# EAGLE design xyzzy_motor_controller_bottom_v1.0 (EAGLE 7.2.1)
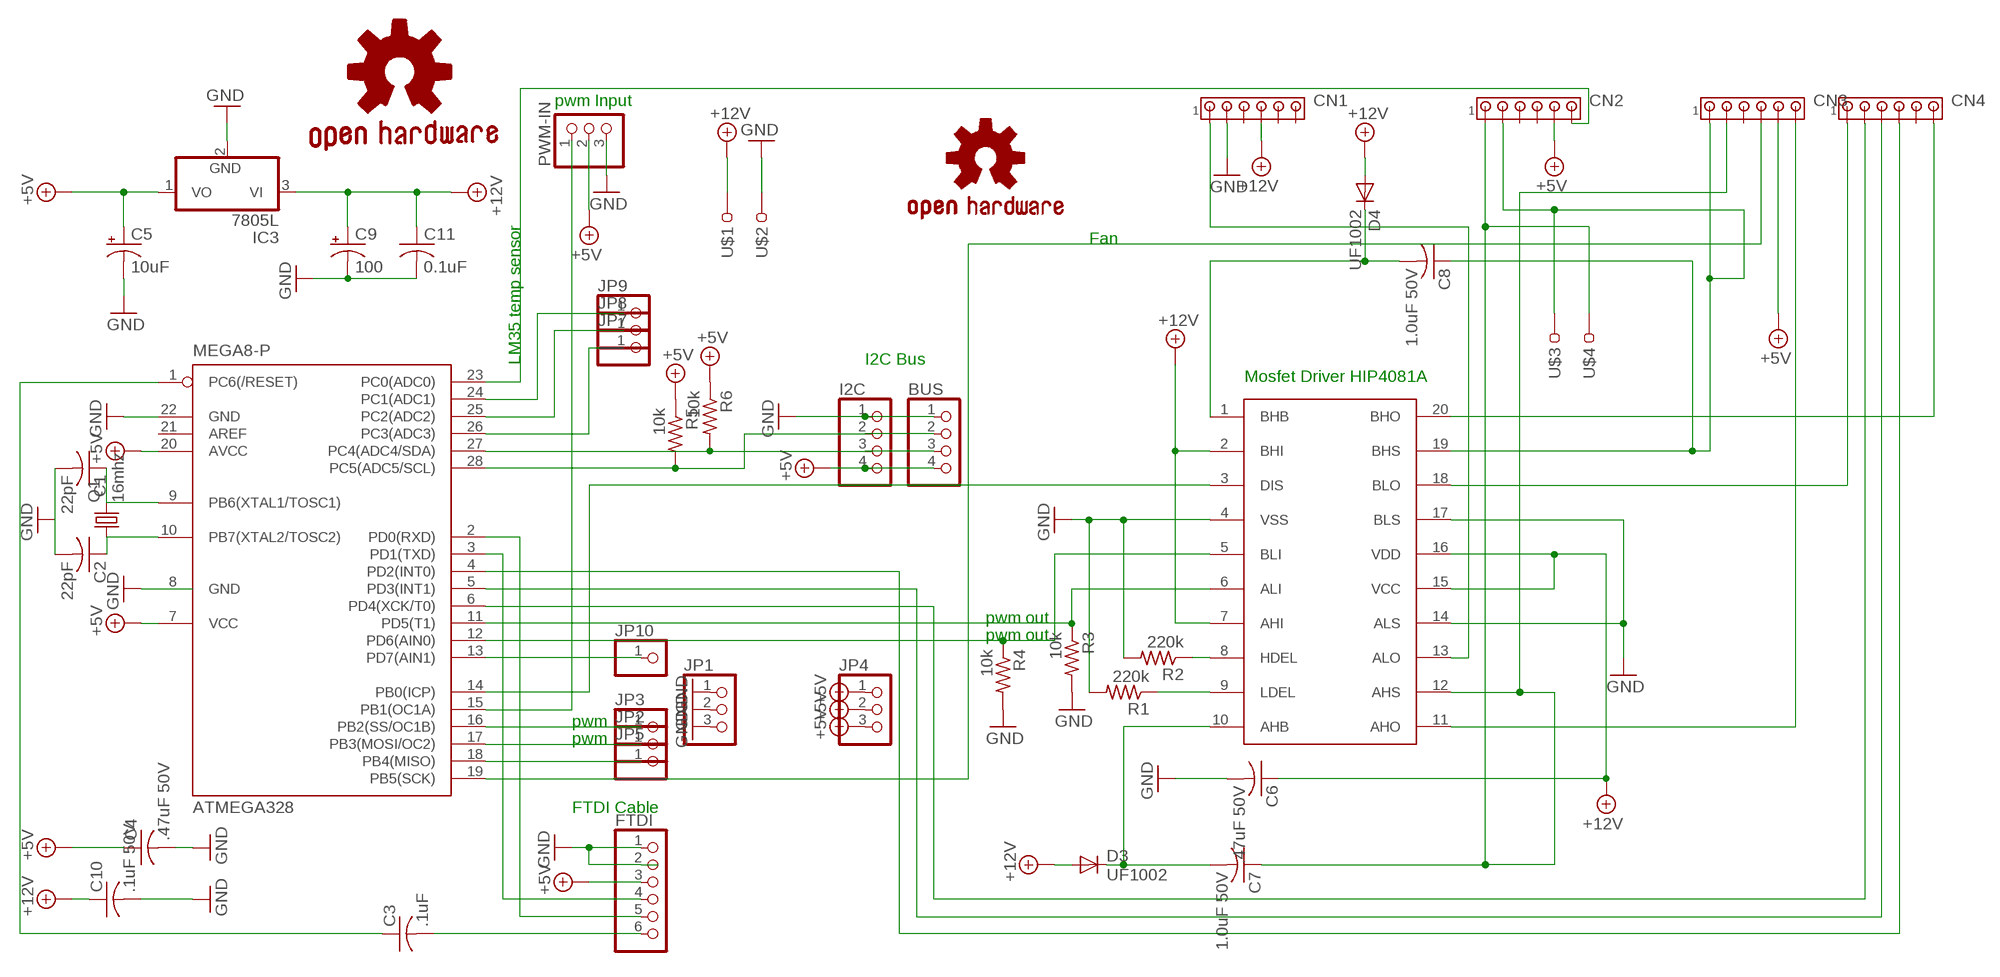
[diagram p0: schematic, sheet 1]

## Parts
ATMEGA328  MEGA8-P  [DIL28-3]
BUS  PINHD-1X4  [1X04]
C1  22pF  C-US025_050-025X075  [C025_050-025X075]
C2  22pF  C-US025_050-025X075  [C025_050-025X075]
C3  .1uF  C-US050-025X075  [C050-025X075]
C4  .47uF 50V  C-US050-025X075  [C050-025X075]
C5  10uF  CPOL-USTT2D4L  [TT2D4L]
C6  .47uF 50V  C-US050-025X075  [C050-025X075]
C7  1.0uF 50V  C-US025-025X050  [C025-025X050]
C8  1.0uF 50V  C-US050-025X075  [C050-025X075]
C9  100  CPOL-USTT2D4L  [TT2D4L]
C10  .1uF 50V  C-US050-025X075  [C050-025X075]
C11  0.1uF  C-US050-025X075  [C050-025X075]
CN1  MTA06-100  [10X06MTA]
CN2  MTA06-100  [10X06MTA]
CN3  MTA06-100  [10X06MTA]
CN4  MTA06-100  [10X06MTA]
D3  UF1002  UF4003  [DO41-10]
D4  UF1002  UF4003  [DO41-10]
FTDI  PINHD-1X6  [1X06]
GOLD_ORB_SM1  OSHWLOGO_GOLD_ORB_LG  [OSHW0]
HIP4081A  HIP4081A  HIP4081ADIP  [DIL20]
I2C  PINHD-1X4  [1X04]
IC3  7805L  [TO92]
JP1  PINHD-1X3  [1X03]
JP2  PINHD-1X1  [1X01]
JP3  PINHD-1X1  [1X01]
JP4  PINHD-1X3  [1X03]
JP5  PINHD-1X1  [1X01]
JP7  PINHD-1X1  [1X01]
JP8  PINHD-1X1  [1X01]
JP9  PINHD-1X1  [1X01]
JP10  PINHD-1X1  [1X01]
LOGO1  OSHW-LOGOL  [OSHW-LOGO-L]
PWM-IN  PINHD-1X3  [1X03]
Q1  16mhz  CRYSTALHC49U-V  [HC49U-V]
R1  220k  R-US_0207/12  [0207/12]
R2  220k  R-US_0207/12  [0207/12]
R3  10k  R-US_0207/12  [0207/12]
R4  10k  R-US_0207/12  [0207/12]
R5  10k  R-US_0207/12  [0207/12]
R6  10k  R-US_0207/12  [0207/12]
U$1  TAB-CON  [SPADE]
U$2  TAB-CON  [SPADE]
U$3  TAB-CON  [SPADE]
U$4  TAB-CON  [SPADE]

## Nets
+5V: ATMEGA328.7(VCC) ATMEGA328.20(AVCC) BUS.4 C4.1 C5.+ CN2.5 CN3.5 I2C.4 IC3.1(VO) JP4.1 JP4.2 JP4.3 PWM-IN.2 R5.1 R6.1
+12V: C6.1 C9.+ C10.1 C11.1 CN1.4 D3.A D4.A HIP4081A.2(BHI) HIP4081A.7(AHI) HIP4081A.15(VCC) HIP4081A.16(VDD) IC3.3(VI) U$1.P$1 U$1.P$2
GND: ATMEGA328.8(GND) ATMEGA328.22(GND) BUS.1 C4.2 C5.- C6.2 C9.- C10.2 C11.2 CN1.2 FTDI.1 FTDI.2 HIP4081A.4(VSS) HIP4081A.14(ALS) HIP4081A.17(BLS) I2C.1 IC3.2(GND) JP1.1 JP1.2 JP1.3 PWM-IN.3 R1.2 R2.2 R3.2 R4.2 U$2.P$1 U$2.P$2
N$1: ATMEGA328.17(PB3(MOSI/OC2)) JP2.1
N$2: C7.2 D3.C HIP4081A.10(AHB)
N$3: ATMEGA328.4(PD2(INT0)) CN4.4
N$4: ATMEGA328.16(PB2(SS/OC1B)) JP3.1
N$5: ATMEGA328.9(PB6(XTAL1/TOSC1)) C1.1 Q1.2
N$6: ATMEGA328.2(PD0(RXD)) FTDI.5
N$7: ATMEGA328.11(PD5(T1)) HIP4081A.6(ALI) R3.1
N$8: CN4.1 HIP4081A.18(BLO)
N$9: CN3.6 HIP4081A.11(AHO)
N$10: ATMEGA328.15(PB1(OC1A)) PWM-IN.1
N$11: ATMEGA328.6(PD4(XCK/T0)) CN4.2
N$12: ATMEGA328.10(PB7(XTAL2/TOSC2)) C2.1 Q1.1
N$13: C1.2 C2.2
N$14: CN1.1 HIP4081A.13(ALO)
N$15: ATMEGA328.3(PD1(TXD)) FTDI.4
N$16: CN4.6 HIP4081A.20(BHO)
N$17: C8.2 D4.C HIP4081A.1(BHB)
N$18: FTDI.3 ; supply symbol labelled +5V
N$19: ATMEGA328.23(PC0(ADC0)) CN2.6
N$20: C7.1 CN2.1 CN3.2 HIP4081A.12(AHS) U$4.P$1 U$4.P$2
N$21: ATMEGA328.28(PC5(ADC5/SCL)) BUS.2 I2C.2 R5.2
N$22: ATMEGA328.12(PD6(AIN0)) HIP4081A.5(BLI) R4.1
N$23: HIP4081A.9(LDEL) R1.1
N$24: HIP4081A.8(HDEL) R2.1
N$25: C8.1 CN2.2 CN3.1 HIP4081A.19(BHS) U$3.P$1 U$3.P$2
N$26: ATMEGA328.14(PB0(ICP)) HIP4081A.3(DIS)
N$27: ATMEGA328.18(PB4(MISO)) JP5.1
N$28: ATMEGA328.19(PB5(SCK)) CN3.4
N$30: ATMEGA328.5(PD3(INT1)) CN4.3
N$33: C3.2 FTDI.6
N$34: ATMEGA328.1(PC6(/RESET)) C3.1
N$35: ATMEGA328.27(PC4(ADC4/SDA)) BUS.3 I2C.3 R6.2
N$36: ATMEGA328.13(PD7(AIN1)) JP10.1
N$41: ATMEGA328.26(PC3(ADC3)) JP7.1
N$45: ATMEGA328.25(PC2(ADC2)) JP8.1
N$47: ATMEGA328.24(PC1(ADC1)) JP9.1
Unconnected: ATMEGA328.21(AREF) CN1.3 CN1.5 CN1.6 CN2.3 CN2.4 CN3.3 CN4.5

## Notes on the sheet
- pwm Input
- Fan
- LM35 temp sensor | I2C Bus
- Mosfet Driver HIP4081A
- pwm out
- pwm out
- pwm
- pwm
- FTDI Cable

## Library data of the parts
ATMEGA328 = atmel:MEGA8-P: MICROCONTROLLER 8 Kbytes FLASH, 1 kbytes SRAM, 512 bytes EEPROM, USART, 4-channel 10 bit ADC, 2-channel 8 bit ADC Pin compatible with Atmega48, ATMega88, ATMega168 Source: avr.lbr; OC_FARNELL: unknown; OC_NEWARK: unknown
BUS I2C = pinhead:PINHD-1X4: PIN HEADER
C1-C4 C6-C8 C10 C11 = rcl:C-US: CAPACITOR, American symbol
C5 C9 = rcl:CPOL-US: POLARIZED CAPACITOR, American symbol
CN1-CN4 = con-amp:MTA06-100: AMP connector Connection corrected 2014-09-19
D3 D4 = diode:UF4003: DIODE ultrafast recovery diode, 200 V rectifier
FTDI = pinhead:PINHD-1X6: PIN HEADER
GOLD_ORB_SM1 = bfl:OSHWLOGO: These are Open-Source Hardware logos.
HIP4081A = andrew_test:HIP4081A
IC3 = linear:78*: Positive VOLTAGE REGULATOR Source: http://cache.national.com/ds/LM/LM78L05.pdf http://www.fairchildsemi.com/ds/LM/LM7805.pdf
JP1 JP4 = adafruit:PINHD-1X3: PIN HEADER
JP2 JP3 JP5 JP7-JP10 = pinhead:PINHD-1X1: PIN HEADER
LOGO1 = SparkFun-Aesthetics:OSHW-LOGO: Open Source Hardware Logo This logo indicates the piece of hardware it is found on incorporates a OSHW license and/or adheres to the definition of open source hardware found here: http://freedomdefined.org/OSHW
PWM-IN = pinhead:PINHD-1X3: PIN HEADER
Q1 = crystal:CRYSTAL: CRYSTAL; OC_FARNELL: 1666969; OC_NEWARK: unknown
R1-R6 = adafruit:R-US_: RESISTOR, American symbol
U$1-U$4 = untitled:TAB-CON: 90 degree spade connector terminal tab. Quick Disconnect Connectors > TE Connectivity AMP Connectors 1217756-1

## Board
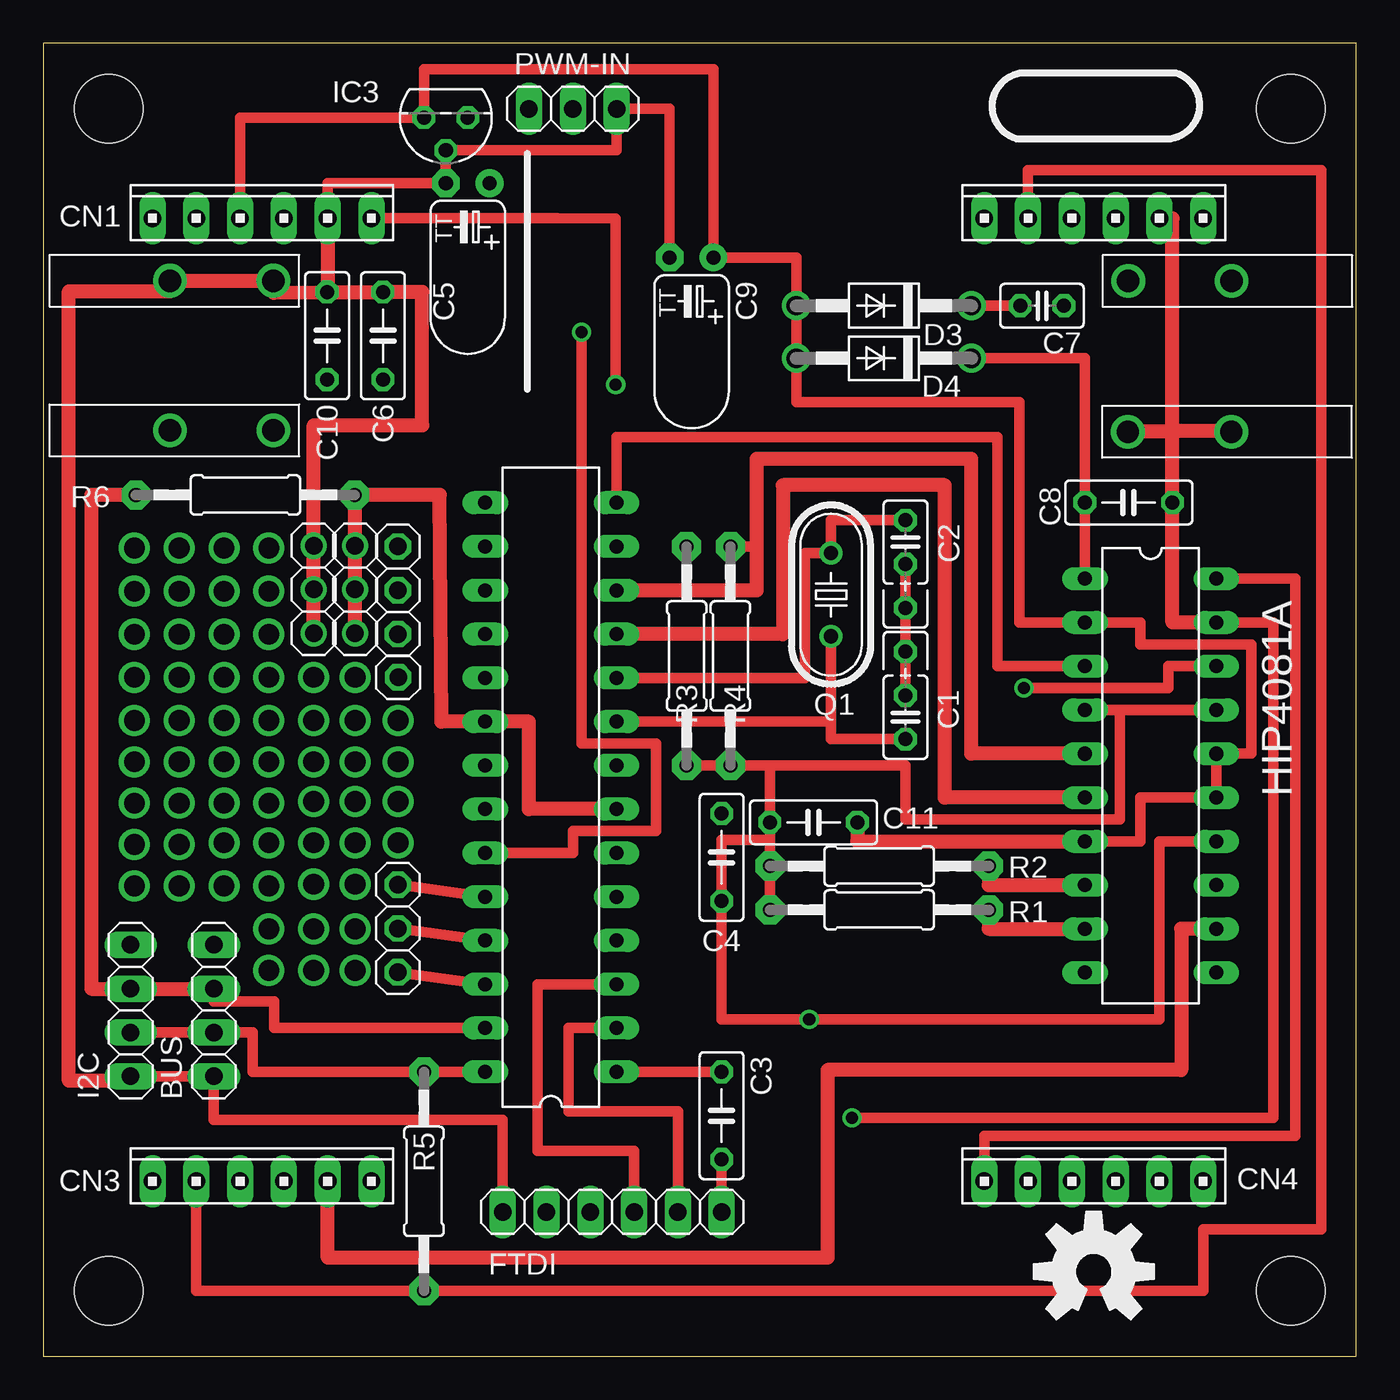
[diagram p1: board, top side]
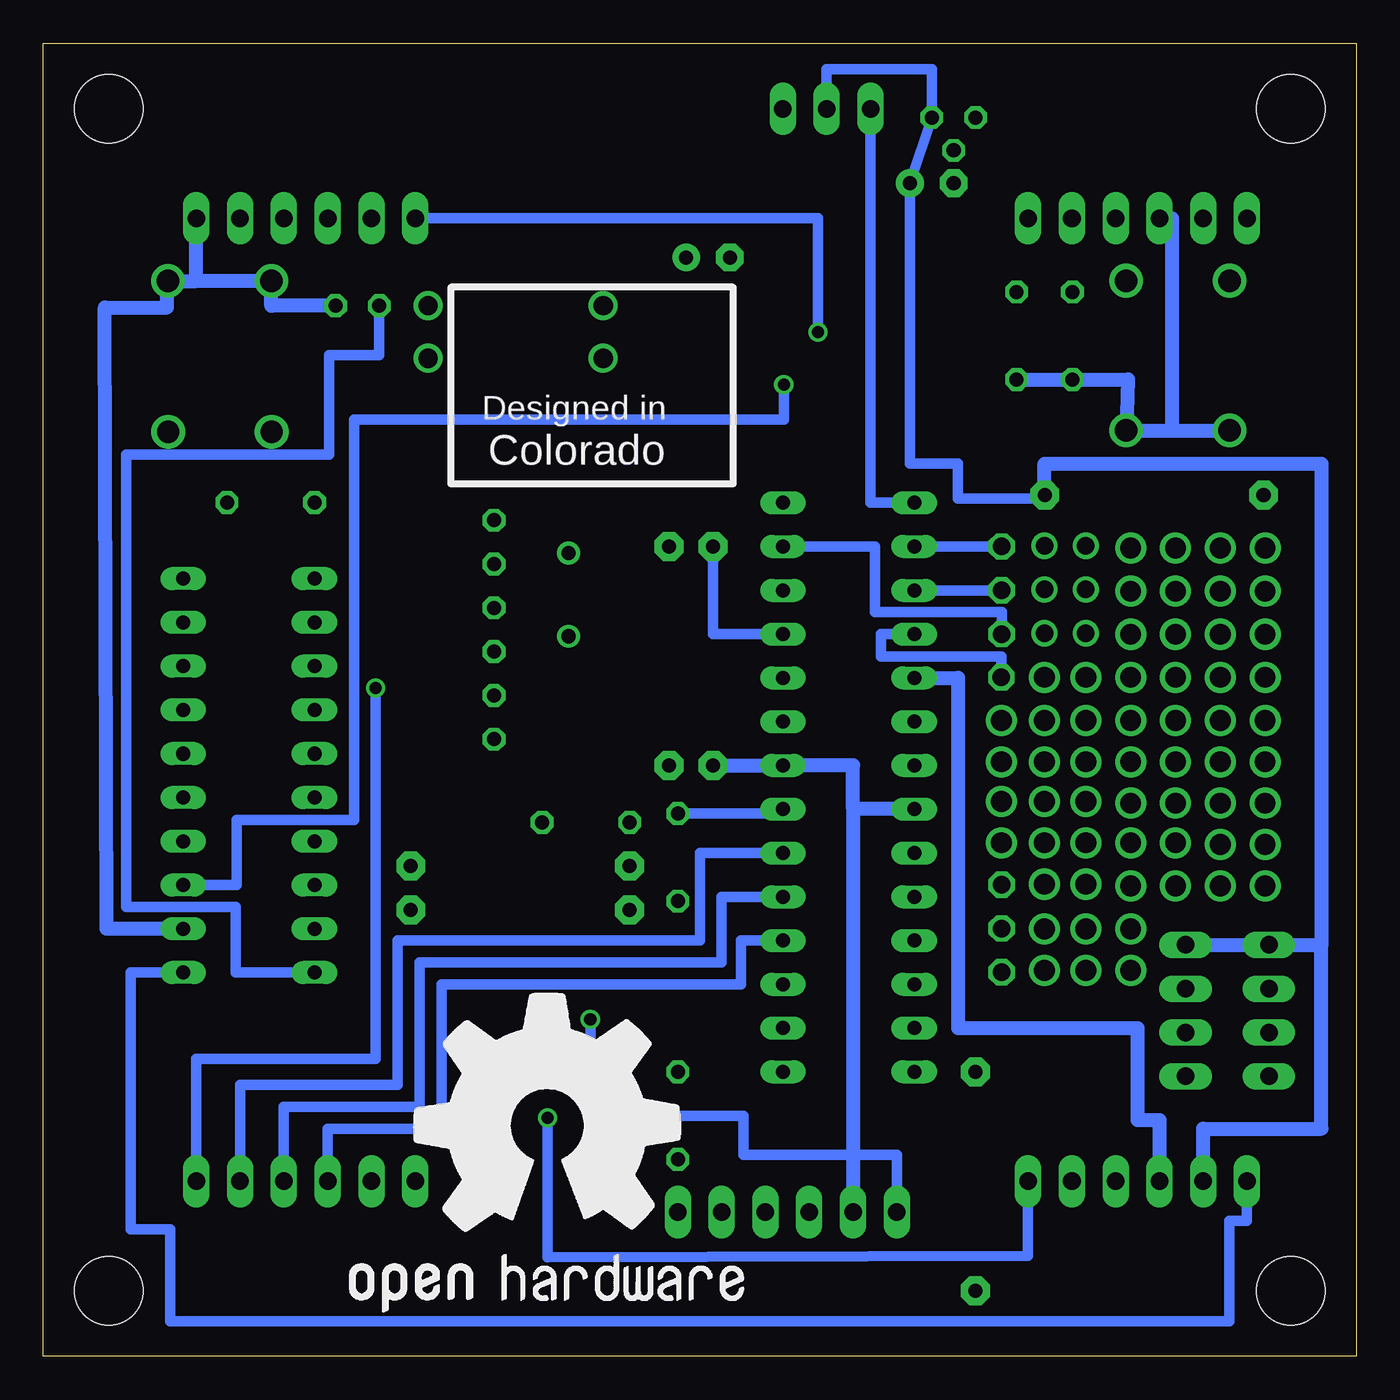
[diagram p2: board, bottom side, seen from below]

Size 76.2 x 76.2 mm. Coordinates in mm from the lower left corner, seen from the top.
Outline: 0,0 76.2,0 76.2,76.2 0,76.2 0,0
Copper layers (1*16): Top 0.035mm / dielectric 1.5mm / Bottom 0.035mm
Design rules "default": minimum track width 10mil, minimum drill 24mil, track to track 8mil, track to pad 8mil, pad to pad 8mil, via to via 8mil, smd to smd 8mil, copper to edge 40mil, drill to drill 8mil, minimum pad ring 10mil, minimum via ring 8mil, stop-mask expansion 4mil, vias tented up to drill 0mil, thermal gap 10mil
Holes 3.97 mm at 72.39,72.39 72.39,3.81 3.81,72.39 3.81,3.81

### Footprints (pad centres in the part's own frame; a part is rotated, then mirrored left to right if it is on the bottom)
DIL28-3 = drill 0.813 long: 1 -16.51,-3.81; 2 -13.97,-3.81; 3 -11.43,-3.81; 4 -8.89,-3.81; 5 -6.35,-3.81; 6 -3.81,-3.81; 7 -1.27,-3.81; 8 1.27,-3.81; 9 3.81,-3.81; 10 6.35,-3.81; 11 8.89,-3.81; 12 11.43,-3.81; 13 13.97,-3.81; 14 16.51,-3.81; 15 16.51,3.81; 16 13.97,3.81; 17 11.43,3.81; 18 8.89,3.81; 19 6.35,3.81; 20 3.81,3.81; 21 1.27,3.81; 22 -1.27,3.81; 23 -3.81,3.81; 24 -6.35,3.81; 25 -8.89,3.81; 26 -11.43,3.81; 27 -13.97,3.81; 28 -16.51,3.81
1X04 = drill 1.016 long: 1 -3.81,0; 2 -1.27,0; 3 1.27,0; 4 3.81,0
C025_050-025X075 = drill 0.813 octagon: 1 -1.27,0; 2 1.27,0; 3 3.81,0
C050-025X075 = drill 0.813 octagon: 1 -2.54,0; 2 2.54,0
TT2D4L = drill 0.813 pad 1.6: + -1.27,0 | drill 0.813 pad 1.6 octagon: - 1.27,0
C025-025X050 = drill 0.813 octagon: 1 -1.27,0; 2 1.27,0
10X06MTA = drill 1.016 long: 1 6.35,0; 2 3.81,0; 3 1.27,0; 4 -1.27,0; 5 -3.81,0; 6 -6.35,0
DO41-10 = drill 1.118: A 5.08,0; C -5.08,0
1X06 = drill 1.016 long: 1 -6.35,0; 2 -3.81,0; 3 -1.27,0; 4 1.27,0; 5 3.81,0; 6 6.35,0
DIL20 = drill 0.813 long: 1 -11.43,-3.81; 2 -8.89,-3.81; 3 -6.35,-3.81; 4 -3.81,-3.81; 5 -1.27,-3.81; 6 1.27,-3.81; 7 3.81,-3.81; 8 6.35,-3.81; 9 8.89,-3.81; 10 11.43,-3.81; 11 11.43,3.81; 12 8.89,3.81; 13 6.35,3.81; 14 3.81,3.81; 15 1.27,3.81; 16 -1.27,3.81; 17 -3.81,3.81; 18 -6.35,3.81; 19 -8.89,3.81; 20 -11.43,3.81
TO92 = drill 0.813 octagon: 1 -1.27,0; 2 0,1.905; 3 1.27,0
1X03 = drill 1.016: 1 -2.54,0; 2 0,0; 3 2.54,0
1X01 = drill 1.016 octagon: 1 0,0
1X03' = drill 1.016 long: 1 -2.54,0; 2 0,0; 3 2.54,0
HC49U-V = drill 0.813: 1 -2.413,0; 2 2.413,0
0207/12 = drill 0.813 pad 1.676 octagon: 1 -6.35,0; 2 6.35,0
SPADE = drill 1.3: P$1 3,0; P$2 -3,0

### Placement (x,y rotation side)
ATMEGA328  29.46,33.02 90 top
BUS  9.91,20.07 90 top
C1  50.04,37.08 90 top
C2  50.04,47.24 270 top
C3  39.37,13.97 270 top
C4  39.37,28.96 270 top
C5  24.64,68.07 180 top
C6  19.72,59.22 90 top
C7  57.96,60.96 180 top
C8  62.99,49.55 180 top
C9  37.62,63.75 180 top
C10  16.48,59.22 90 top
C11  44.7,30.99 180 top
CN1  12.7,66.04 0 top
CN2  60.96,66.04 0 top
CN3  12.7,10.16 0 top
CN4  60.96,10.16 0 top
D3  48.78,60.96 180 top
D4  48.78,57.91 180 top
FTDI  33.02,8.38 0 top
GOLD_ORB_SM1  59.69,-0.87 0 bottom
HIP4081A  64.26,33.7 270 top
I2C  5.08,20.07 90 top
IC3  23.37,71.88 180 top
JP1  15.7,44.5 270 top
JP2  20.58,44.45 0 top
JP3  20.58,46.99 0 top
JP4  18.1,44.5 270 top
JP5  20.6,39.4 0 top
JP7  20.58,22.29 0 top
JP8  20.58,24.83 0 top
JP9  20.58,27.37 0 top
JP10  20.58,41.91 0 top
LOGO1  60.96,4.92 0 top
PWM-IN  [1X03']  30.73,72.39 0 top
Q1  45.72,44.2 270 top
R1  48.51,25.91 180 top
R2  48.51,28.45 180 top
R3  37.34,40.64 270 top
R4  39.88,40.64 270 top
R5  22.1,10.16 90 top
R6  11.74,49.98 180 top
U$1  10.36,53.73 180 top
U$2  10.36,62.41 180 top
U$3  65.94,53.64 0 top
U$4  65.96,62.39 0 top

### Tracks (layer width: path | path; a pad name or v marks a point on that pad's centre or on a via)
+5V
  Top 0.61: CN3.5 8.89,3.81 R5.1 67.31,3.81 67.31,7.37 74.17,7.37 74.17,68.83 57.15,68.83 CN2.5
  Top 0.813: ATMEGA328.7 28.19,31.75 28.19,36.83 ATMEGA328.20 23.11,36.83 23.01,49.98 R6.1 JP4.1 JP4.2 JP4.3
  Bottom 0.61: C4.1 33.27,31.5 ATMEGA328.7 | PWM-IN.2 30.73,74.68 24.64,74.68 IC3.1 C5.+ 25.91,51.82 23.11,51.82 23.11,49.78 18.54,49.78 R6.1
  Bottom 0.813: CN3.5 8.89,13.21 2.03,13.21 2.03,23.88 | I2C.4 BUS.4 2.03,23.88 | R6.1 18.1,50.08 18.1,51.8 2.03,51.8 2.03,23.88
+12V
  Top 0.61: HIP4081A.7 63.65,29.89 63.65,32.43 HIP4081A.15 HIP4081A.16 70.1,34.97 70.1,41.32 63.65,41.32 63.65,42.59 HIP4081A.2 56.64,42.59 56.64,55.37 43.7,55.37 D4.A D3.A 43.7,63.75 C9.+ 38.89,74.68 22.1,74.68 IC3.3 11.43,71.88 CN1.4
  Top 0.813: C11.1 47.24,29.89 HIP4081A.7
  Bottom 0.813: C6.1 C10.1 13.26,56.68 U$1.P$2 10.7,53.73 | 10.7,53.73 U$1.P$1 | CN1.4 10.7,66.04 10.7,53.73
GND  (via drill 0.7)
  Top 0.61: I2C.1 5.59,16.26 9.89,16.26 | BUS.1 9.89,16.26 | 9.89,16.26 9.89,13.72 26.67,13.72 FTDI.1 | C11.2 42.16,29.97 39.37,29.97 C4.2 39.37,19.56 v44.45,19.56 44.45,19.54 64.77,19.54 64.77,29.89 HIP4081A.14 | R3.2 R4.2 42.16,34.29 | C11.2 42.16,34.29 | R1.2 R2.2 C11.2 | 62.48,37.51 HIP4081A.4 | HIP4081A.17 62.48,37.51 | 62.48,37.51 62.48,31.16 50.04,31.16 50.04,34.29 42.16,34.29 | C9.- 36.35,72.39 PWM-IN.3 33.27,69.98 IC3.2 C5.- 16.51,68.07 CN1.2
  Top 0.813: 5.59,16.26 5.59,16 1.5,16 1.5,61.8 7.36,61.8 U$2.P$1 U$2.P$2 13.38,61.71 C10.2 16.51,61.76 | 16.51,61.76 C6.2 22,61.76 22,54.03 15.7,54.03 JP1.1 JP1.2 JP1.3 | CN1.2 16.51,61.76
  Bottom 0.61: FTDI.1 26.67,11.68 29.21,11.68 | FTDI.2 29.21,11.68 | 29.21,11.68 35.56,11.68 35.56,13.97 44.45,13.97 v44.45,19.56
  Bottom 0.813: R3.2 ATMEGA328.8 29.21,34.29 29.21,31.75 | 29.21,31.75 29.21,7.87 | ATMEGA328.22 29.21,31.75
N$1
  Bottom 0.61: ATMEGA328.17 JP2.1
N$2
  Top 0.61: C7.2 D3.C
  Bottom 0.61: HIP4081A.10 65.02,22.27 65.02,26.08 71.37,26.08 71.37,52.32 59.6,52.32 59.6,58.1 56.69,58.1 C7.2
N$3
  Bottom 0.61: CN4.4 59.69,13.21 53.09,13.21 53.09,21.59 35.71,21.59 35.71,24.13 ATMEGA328.4
N$4
  Bottom 0.61: ATMEGA328.16 JP3.1
N$5
  Top 0.61: Q1.2 45.72,36.83 | 45.72,36.83 45.72,35.81 C1.1 | ATMEGA328.9 45.72,36.83
N$6
  Top 0.61: FTDI.5 36.83,14.22 30.48,14.22 30.48,19.05 ATMEGA328.2
N$7
  Top 0.813: HIP4081A.6 52.32,32.43 52.32,50.55 42.93,50.55 42.93,41.91 ATMEGA328.11
  Bottom 0.61: R3.1 37.34,41.91 ATMEGA328.11
N$8  (via drill 0.7)
  Top 0.61: HIP4081A.18 65.28,40.05 65.28,38.78 v56.9,38.78
  Bottom 0.61: v56.9,38.78 56.9,17.27 67.31,17.27 CN4.1
N$9
  Bottom 0.61: CN3.6 6.35,7.87 7.37,7.87 7.37,2.03 68.83,2.03 68.83,7.37 71.12,7.37 71.12,22.27 HIP4081A.11
N$10
  Bottom 0.61: ATMEGA328.15 28.19,49.53 PWM-IN.1
N$11
  Bottom 0.61: ATMEGA328.6 38.1,29.21 38.1,24.13 55.63,24.13 55.63,15.75 64.77,15.75 CN4.2
N$12
  Top 0.61: ATMEGA328.10 44.2,39.37 44.2,46.61 Q1.1 45.72,48.51 C2.1
N$13
  Top 0.61: C2.2 C1.2
N$14  (via drill 0.7)
  Top 0.61: v33.23,56.39 33.23,66.02 33.22,66.02 29.82,66.04 CN1.1
  Bottom 0.61: HIP4081A.13 64.98,27.35 64.98,31.12 58.17,31.12 58.17,54.36 33.23,54.36 v33.23,56.39
N$15
  Top 0.61: ATMEGA328.3 28.7,21.59 28.7,11.94 34.29,11.94 FTDI.4
N$16
  Top 0.61: HIP4081A.20 72.64,45.13 72.64,12.79 54.61,12.79 CN4.6
N$17
  Top 0.61: HIP4081A.1 C8.2 60.45,57.91 D4.C
N$19  (via drill 0.7)
  Top 0.61: ATMEGA328.23 30.73,29.21 30.73,30.48 35.56,30.48 35.56,35.56 31.24,35.56 v31.24,59.44
  Bottom 0.61: CN2.6 31.24,66.04 v31.24,59.44
N$20
  Top 0.813: HIP4081A.12 66.04,24.81 66.04,16.62 45.51,16.62 45.51,5.73 16.51,5.73 CN3.2
  Bottom 0.813: HIP4081A.12 72.52,24.81 72.62,60.86 69.01,60.86 U$4.P$1 67.51,62.4 67.31,62.4 | 67.31,62.4 CN2.1 | C7.1 62.95,60.96 U$4.P$2 67.31,62.4
N$21
  Top 0.61: ATMEGA328.28 R5.2 12.17,16.51 12.17,18.8 BUS.2 I2C.2
N$22
  Top 0.61: R4.1 41.4,46.99
  Top 0.813: HIP4081A.5 53.85,34.97 53.85,52.07 41.4,52.07 41.4,46.99 41.4,44.45 ATMEGA328.12
N$23
  Top 0.813: R1.1 54.86,24.81 HIP4081A.9
N$24
  Top 0.813: R2.1 54.86,27.35 HIP4081A.8
N$25  (via drill 0.7)
  Top 0.61: HIP4081A.19 71.37,42.59 71.37,13.85 v46.94,13.85
  Top 0.813: HIP4081A.19 65.53,42.59 C8.1 65.53,53.7 | 65.53,53.7 65.53,66.04 CN2.2 | U$3.P$2 62.94,53.7 65.53,53.7 | U$3.P$1 68.94,53.7 65.53,53.7
  Bottom 0.61: CN3.1 19.05,5.84 46.94,5.74 v46.94,13.85
N$26
  Top 0.61: HIP4081A.3 55.37,40.05 55.37,53.34 33.27,53.34 ATMEGA328.14
N$27
  Bottom 0.61: JP5.1 20.6,40.6 27.6,40.6 27.6,41.91 ATMEGA328.18
N$28
  Bottom 0.813: ATMEGA328.19 23.11,39.37 23.11,19.05 12.7,19.05 12.7,13.72 11.43,13.72 CN3.4
N$29  (via drill 1.2)
  other vias: 18.1,39.4
N$30
  Bottom 0.61: CN4.3 62.23,14.48 54.36,14.48 54.36,22.86 36.83,22.86 36.83,26.67 ATMEGA328.5
N$31  (via drill 1.2)
  other vias: 15.7,39.4
N$32  (via drill 1.2)
  other vias: 20.6,36.9
N$33
  Top 0.61: FTDI.6 C3.2
N$34
  Top 0.61: ATMEGA328.1 C3.1
N$35
  Top 0.61: ATMEGA328.27 13.4,19.05 13.4,20.6 9.91,20.6 BUS.3
  Top 0.813: R6.2 2.79,49.98 2.79,21.34 I2C.3 BUS.3
N$36
  Bottom 0.61: JP10.1 20.58,43.18 27.94,43.18 27.94,46.99 ATMEGA328.13
N$37  (via drill 1.2)
  other vias: 18.1,36.9
N$38  (via drill 1.2)
  other vias: 15.7,36.9
N$39  (via drill 1.2)
  other vias: 20.6,34.5
N$40  (via drill 1.2)
  other vias: 18.1,34.5
N$41
  Top 0.61: JP7.1 ATMEGA328.26
N$42  (via drill 1.2)
  other vias: 15.7,34.5
N$43  (via drill 1.2)
  other vias: 15.7,32.2
N$44  (via drill 1.2)
  other vias: 18.1,32.2
N$45
  Top 0.61: JP8.1 ATMEGA328.25
N$46  (via drill 1.2)
  other vias: 20.6,32.2
N$47
  Top 0.61: JP9.1 ATMEGA328.24
N$48  (via drill 1.2)
  other vias: 20.6,29.8
N$49  (via drill 1.2)
  other vias: 18.1,29.8
N$51  (via drill 1.2)
  other vias: 18.1,27.4
N$52  (via drill 1.2)
  other vias: 18.1,24.8
N$53  (via drill 1.2)
  other vias: 18.1,22.4
N$54  (via drill 1.2)
  other vias: 15.7,29.8
N$55  (via drill 1.2)
  other vias: 15.7,27.4
N$56  (via drill 1.2)
  other vias: 15.7,24.8
N$57  (via drill 1.2)
  other vias: 15.7,22.4
N$59  (via drill 1.2)
  other vias: 13.1,39.4
N$61  (via drill 1.2)
  other vias: 10.5,39.4
N$63  (via drill 1.2)
  other vias: 7.9,39.4
N$65  (via drill 1.2)
  other vias: 5.3,39.4
N$67  (via drill 1.2)
  other vias: 13.1,36.9
N$69  (via drill 1.2)
  other vias: 10.5,36.9
N$71  (via drill 1.2)
  other vias: 7.9,36.9
N$73  (via drill 1.2)
  other vias: 5.3,36.9
N$74  (via drill 1.2)
  other vias: 13.1,34.5
N$75  (via drill 1.2)
  other vias: 10.5,34.5
N$76  (via drill 1.2)
  other vias: 7.9,34.5
N$77  (via drill 1.2)
  other vias: 5.3,34.5
N$78  (via drill 1.2)
  other vias: 13.1,41.9
N$79  (via drill 1.2)
  other vias: 13.1,32.1
N$81  (via drill 1.2)
  other vias: 10.5,32.1
N$82  (via drill 1.2)
  other vias: 13.1,44.4
N$84  (via drill 1.2)
  other vias: 5.3,32.1
N$85  (via drill 1.2)
  other vias: 7.9,32.1
N$86  (via drill 1.2)
  other vias: 13.1,46.9
N$87  (via drill 1.2)
  other vias: 10.5,41.9
N$88  (via drill 1.2)
  other vias: 10.5,44.4
N$89  (via drill 1.2)
  other vias: 5.3,29.7
N$90  (via drill 1.2)
  other vias: 10.5,46.9
N$91  (via drill 1.2)
  other vias: 5.3,27.3
N$92  (via drill 1.2)
  other vias: 7.9,46.9
N$93  (via drill 1.2)
  other vias: 7.9,44.4
N$94  (via drill 1.2)
  other vias: 7.9,29.7
N$95  (via drill 1.2)
  other vias: 7.9,41.9
N$96  (via drill 1.2)
  other vias: 7.9,27.3
N$97  (via drill 1.2)
  other vias: 13.1,29.8
N$98  (via drill 1.2)
  other vias: 10.5,29.8
N$99  (via drill 1.2)
  other vias: 5.3,46.9
N$100  (via drill 1.2)
  other vias: 5.3,44.4
N$102  (via drill 1.2)
  other vias: 5.3,41.9
N$104  (via drill 1.2)
  other vias: 10.5,27.3
N$105  (via drill 1.2)
  other vias: 13.1,27.3
N$106  (via drill 1.2)
  other vias: 13.1,24.8
N$107  (via drill 1.2)
  other vias: 13.1,22.4

### Text on the board
bPlace: Designed in | Colorado
tValues: BioLumo | XYZZY | Motor Controller | Prototype V1.0 | CN2 | GND | Motor | +12V | DIS | D9 | pwm out | pwm out | D8 | 10 | 11 | D6 | 7 | D5 | 12 | D13 | A0 | A1 | +5V | A2 | A3 | TX | RX | SDA | SCL | GND | Bottom Board | BLK | CTS | 5V | RX | TX | RST | grn | ...a maze of twisty little passages, all alike...
bValues: 6 | 5 | 4 | 3 | 2 | 1 | 6 | 5 | 4 | 3 | 2 | 1 | 6 | 5 | 4 | 3 | 2 | 1 | 6 | 5 | 4 | 3 | 2 | 1